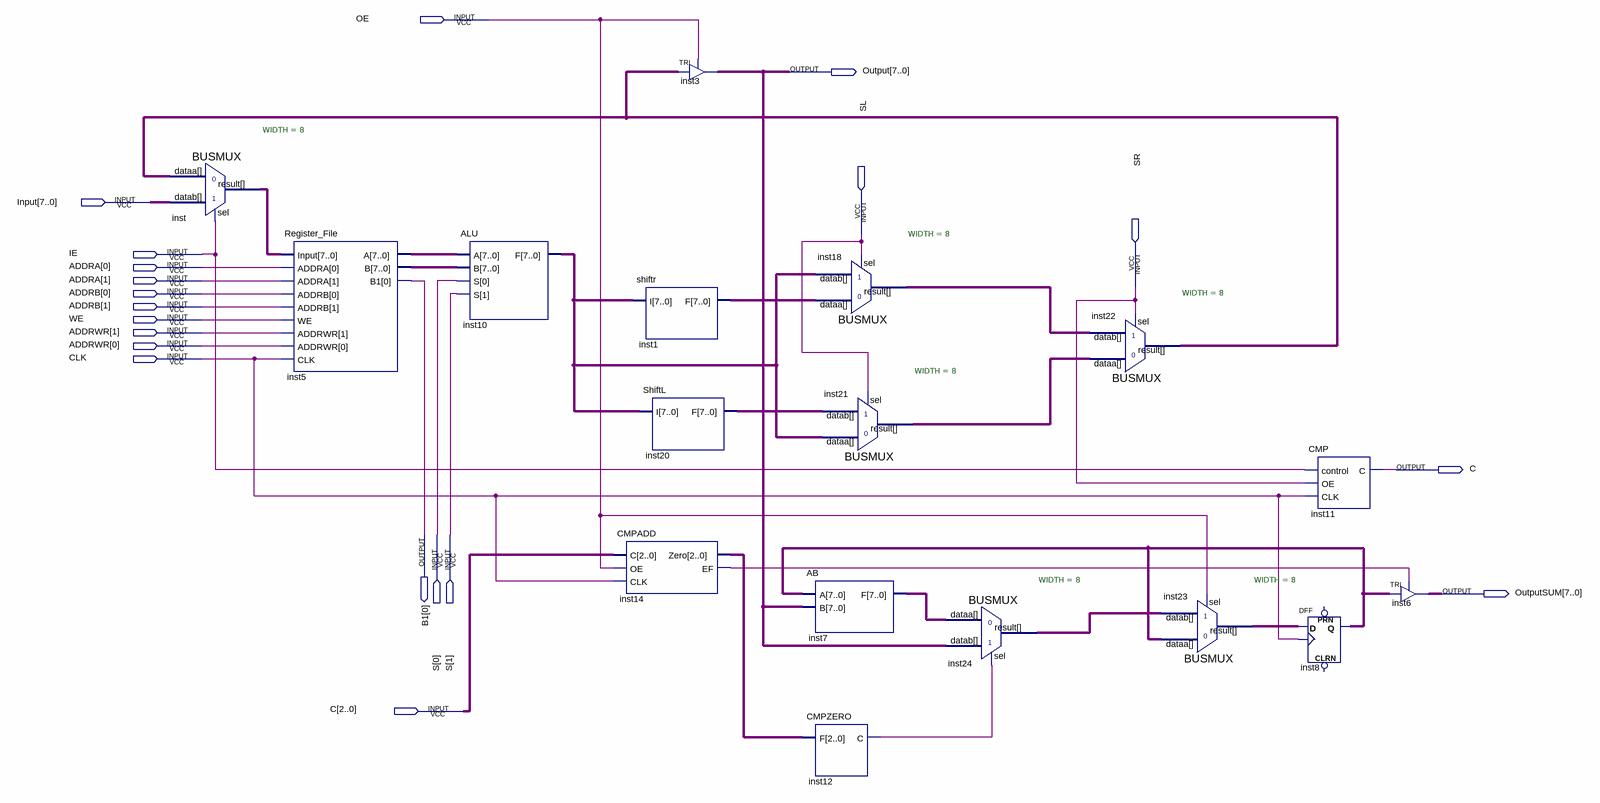
[diagram p0: schematic sheet]
// Quartus schematic Datapath.bdf as structural Verilog: 17 symbols, 20 pins
module Datapath (
  input  OE,
  input  [7:0] Input,
  input  SL,
  input  IE,
  input  [1:0] ADDRA,
  input  SR,
  input  [1:0] ADDRB,
  input  WE,
  input  [1:0] ADDRWR,
  input  CLK,
  input  [1:0] S,
  input  [2:0] C,
  output [7:0] Output,
  output C_1bit,
  output [0:0] B1,
  output [7:0] OutputSUM
);

  wire inst12_c, inst14_ef;
  wire [2:0] inst14_zero;
  wire [7:0] inst1_f, inst5_a, inst5_b, inst7_f, inst8_q, inst10_f, inst18_result, inst20_f, inst21_result,
       inst22_result, inst23_result, inst24_result, inst_result;

  BUSMUX #(.WIDTH(8)) inst (.dataa(inst22_result), .datab(Input), .sel(IE), .result(inst_result));
  Register_File inst5 (
    .Input(inst_result), .ADDRA(ADDRA), .ADDRB(ADDRB), .WE(WE), .ADDRWR(ADDRWR), .CLK(CLK), .A(inst5_a),
    .B(inst5_b), .B1(B1[0]));
  ALU inst10 (.A(inst5_a), .B(inst5_b), .S(S), .F(inst10_f));
  CMPADD inst14 (.C(C), .OE(OE), .CLK(CLK), .Zero(inst14_zero), .EF(inst14_ef));
  shiftr inst1 (.I(inst10_f), .F(inst1_f));
  ShiftL inst20 (.I(inst10_f), .F(inst20_f));
  TRI inst3[7:0] (.IN(inst22_result), .OE(OE), .OUT(Output));
  BUSMUX #(.WIDTH(8)) inst18 (.dataa(inst1_f), .datab(inst10_f), .sel(SL), .result(inst18_result));
  BUSMUX #(.WIDTH(8)) inst21 (.dataa(inst10_f), .datab(inst20_f), .sel(SL), .result(inst21_result));
  AB inst7 (.A(inst8_q), .B(Output), .F(inst7_f));
  CMPZERO inst12 (.F(inst14_zero), .C(inst12_c));
  BUSMUX #(.WIDTH(8)) inst24 (.dataa(inst7_f), .datab(Output), .sel(inst12_c), .result(inst24_result));
  BUSMUX #(.WIDTH(8)) inst22 (.dataa(inst21_result), .datab(inst18_result), .sel(SR), .result(inst22_result));
  BUSMUX #(.WIDTH(8)) inst23 (.dataa(inst8_q), .datab(inst24_result), .sel(OE), .result(inst23_result));
  CMP inst11 (.control(IE), .OE(SR), .CLK(CLK), .C(C_1bit));
  DFF inst8[7:0] (.CLK(CLK), .D(inst23_result), .Q(inst8_q));  // open: CLRN, PRN
  TRI inst6[7:0] (.IN(inst8_q), .OE(inst14_ef), .OUT(OutputSUM));
endmodule
